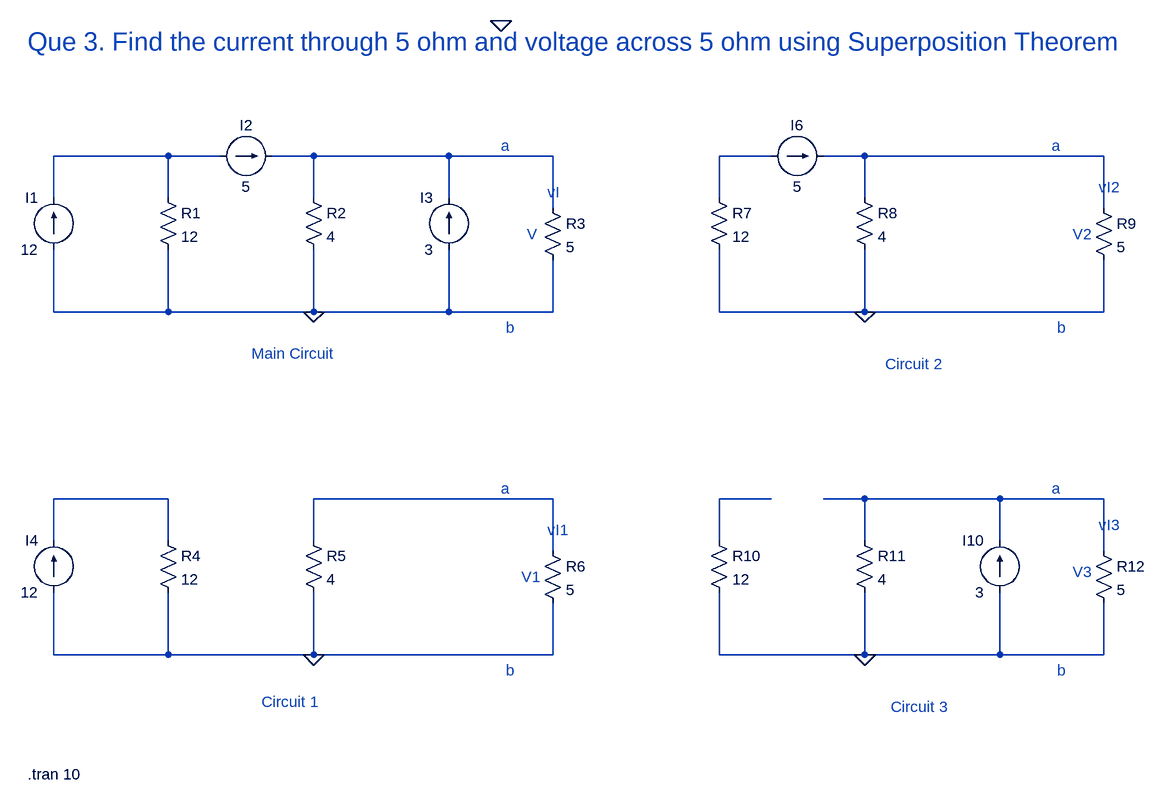
[diagram p0: schematic 3_Dheerendra_23EE019_Superposition_3.asc]
3_Dheerendra_23EE019_Superposition_3.asc, the LTspice schematic file:
Version 4
SHEET 1 1444 1176
WIRE -512 208 -688 208
WIRE -432 208 -512 208
WIRE -288 208 -352 208
WIRE -80 208 -288 208
WIRE 80 208 -80 208
WIRE 416 208 336 208
WIRE 560 208 496 208
WIRE 928 208 560 208
WIRE -688 272 -688 208
WIRE -512 272 -512 208
WIRE -288 272 -288 208
WIRE -80 272 -80 208
WIRE 336 272 336 208
WIRE 560 272 560 208
WIRE 80 288 80 208
WIRE 928 288 928 208
WIRE -688 448 -688 352
WIRE -512 448 -512 352
WIRE -512 448 -688 448
WIRE -288 448 -288 352
WIRE -288 448 -512 448
WIRE -80 448 -80 352
WIRE -80 448 -288 448
WIRE 80 448 80 368
WIRE 80 448 -80 448
WIRE 336 448 336 352
WIRE 560 448 560 352
WIRE 560 448 336 448
WIRE 928 448 928 368
WIRE 928 448 560 448
WIRE -512 736 -688 736
WIRE 80 736 -288 736
WIRE 416 736 336 736
WIRE 560 736 496 736
WIRE 768 736 560 736
WIRE 928 736 768 736
WIRE -688 800 -688 736
WIRE -512 800 -512 736
WIRE -288 800 -288 736
WIRE 336 800 336 736
WIRE 560 800 560 736
WIRE 768 800 768 736
WIRE 80 816 80 736
WIRE 928 816 928 736
WIRE -688 976 -688 880
WIRE -512 976 -512 880
WIRE -512 976 -688 976
WIRE -288 976 -288 880
WIRE -288 976 -512 976
WIRE 80 976 80 896
WIRE 80 976 -288 976
WIRE 336 976 336 880
WIRE 560 976 560 880
WIRE 560 976 336 976
WIRE 768 976 768 880
WIRE 768 976 560 976
WIRE 928 976 928 896
WIRE 928 976 768 976
FLAG -288 448 0
FLAG -288 976 0
FLAG 560 448 0
FLAG 560 976 0
FLAG 0 0 0
SYMBOL res -528 256 R0
SYMATTR InstName R1
SYMATTR Value 12
SYMBOL res -304 256 R0
SYMATTR InstName R2
SYMATTR Value 4
SYMBOL current -688 352 R180
WINDOW 0 24 80 Left 2
WINDOW 3 24 0 Left 2
WINDOW 123 0 0 Left 0
WINDOW 39 0 0 Left 0
SYMATTR InstName I1
SYMATTR Value 12
SYMBOL current -432 208 R270
WINDOW 0 32 40 VTop 2
WINDOW 3 -32 40 VBottom 2
WINDOW 123 0 0 Left 0
WINDOW 39 0 0 Left 0
SYMATTR InstName I2
SYMATTR Value 5
SYMBOL current -80 352 R180
WINDOW 0 24 80 Left 2
WINDOW 3 24 0 Left 2
WINDOW 123 0 0 Left 0
WINDOW 39 0 0 Left 0
SYMATTR InstName I3
SYMATTR Value 3
SYMBOL res 64 272 R0
SYMATTR InstName R3
SYMATTR Value 5
SYMBOL res -528 784 R0
SYMATTR InstName R4
SYMATTR Value 12
SYMBOL res -304 784 R0
SYMATTR InstName R5
SYMATTR Value 4
SYMBOL current -688 880 R180
WINDOW 0 24 80 Left 2
WINDOW 3 24 0 Left 2
WINDOW 123 0 0 Left 0
WINDOW 39 0 0 Left 0
SYMATTR InstName I4
SYMATTR Value 12
SYMBOL res 64 800 R0
SYMATTR InstName R6
SYMATTR Value 5
SYMBOL res 320 256 R0
SYMATTR InstName R7
SYMATTR Value 12
SYMBOL res 544 256 R0
SYMATTR InstName R8
SYMATTR Value 4
SYMBOL current 416 208 R270
WINDOW 0 32 40 VTop 2
WINDOW 3 -32 40 VBottom 2
WINDOW 123 0 0 Left 0
WINDOW 39 0 0 Left 0
SYMATTR InstName I6
SYMATTR Value 5
SYMBOL res 912 272 R0
SYMATTR InstName R9
SYMATTR Value 5
SYMBOL res 320 784 R0
SYMATTR InstName R10
SYMATTR Value 12
SYMBOL res 544 784 R0
SYMATTR InstName R11
SYMATTR Value 4
SYMBOL current 768 880 R180
WINDOW 0 24 80 Left 2
WINDOW 3 24 0 Left 2
WINDOW 123 0 0 Left 0
WINDOW 39 0 0 Left 0
SYMATTR InstName I10
SYMATTR Value 3
SYMBOL res 912 800 R0
SYMATTR InstName R12
SYMATTR Value 5
TEXT -728 32 Left 4 ;Que 3. Find the current through 5 ohm and voltage across 5 ohm using Superposition Theorem
TEXT 0 192 Left 2 ;a
TEXT 8 472 Left 2 ;b
TEXT 0 720 Left 2 ;a
TEXT 8 1000 Left 2 ;b
TEXT -384 512 Left 2 ;Main Circuit
TEXT -368 1048 Left 2 ;Circuit 1
TEXT 848 192 Left 2 ;a
TEXT 856 472 Left 2 ;b
TEXT 848 720 Left 2 ;a
TEXT 856 1000 Left 2 ;b
TEXT 600 1056 Left 2 ;Circuit 3
TEXT 592 528 Left 2 ;Circuit 2
TEXT -728 1160 Left 2 !.tran 10
TEXT 40 328 Left 2 ;V
TEXT 32 856 Left 2 ;V1
TEXT 880 848 Left 2 ;V3
TEXT 880 328 Left 2 ;V2
TEXT 72 264 Left 2 ;vI
TEXT 72 784 Left 2 ;vI1
TEXT 920 256 Left 2 ;vI2
TEXT 920 776 Left 2 ;vI3

The netlist it stands for:
* 3_Dheerendra_23EE019_Superposition_3.asc
R1 N001 0 12
R2 N002 0 4
I1 0 N001 12
I2 N001 N002 5
I3 0 N002 3
R3 N002 0 5
R4 N005 0 12
R5 N006 0 4
I4 0 N005 12
R6 N006 0 5
R7 N003 0 12
R8 N004 0 4
I6 N003 N004 5
R9 N004 0 5
R10 N007 0 12
R11 N008 0 4
I10 0 N008 3
R12 N008 0 5
* Que 3. Find the current through 5 ohm and voltage across 5 ohm using Superposition Theorem
* a
* b
* a
* b
* Main Circuit
* Circuit 1
* a
* b
* a
* b
* Circuit 3
* Circuit 2
.tran 10
* V
* V1
* V3
* V2
* vI
* vI1
* vI2
* vI3
.backanno
.end